# Altium schematic sheet [3] TopLevel.SchDoc: =DocumentName
size A3; Organization: ORGANIZATION; Address1: R. Aprígio Veloso, 882, Universitário; Address2: Campina Grande - PB; Address3: 58429-900; DocumentNumber: 3; Revision: -; SheetNumber: 3; SheetTotal: 9; ENG_DATE: --/--/--; DSN_DATE: --/--/--; CHK_DATE: --/--/--; SCH_SCALE: 1:1
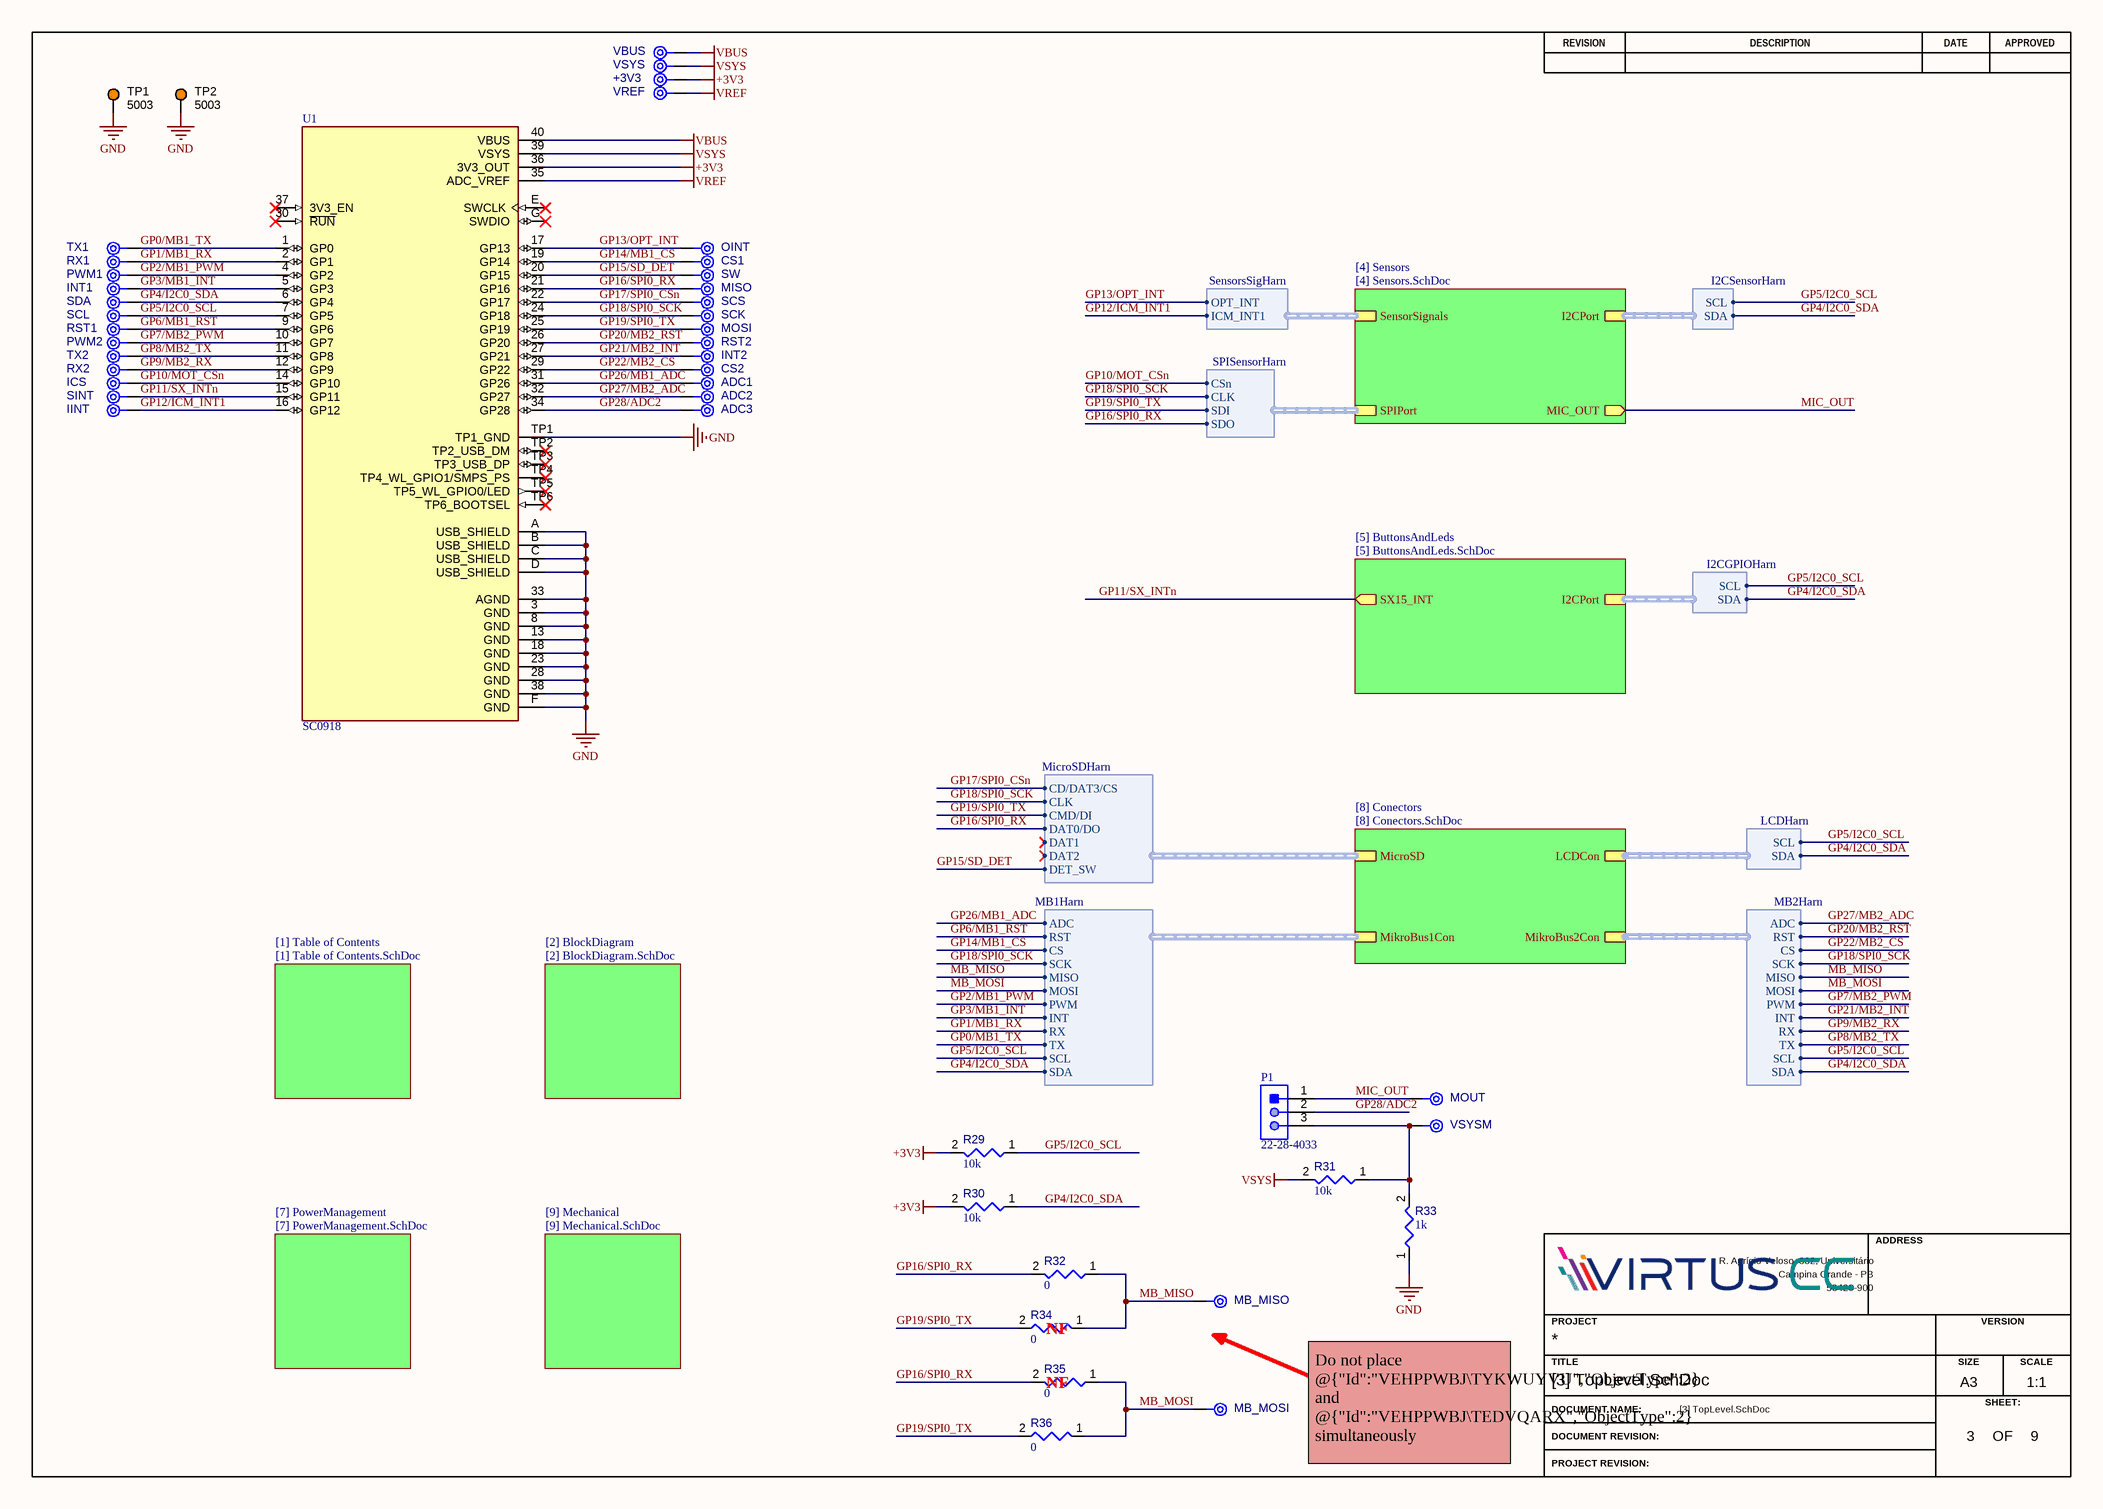
[diagram p0: [3] TopLevel.SchDoc]

## Parts
+3V3  TPAD6R  [TP06R]  (value not drawn)  (no BOM)
ADC1  TPAD6R  [TP06R]  (value not drawn)  (no BOM)
ADC2  TPAD6R  [TP06R]  (value not drawn)  (no BOM)
ADC3  TPAD6R  [TP06R]  (value not drawn)  (no BOM)
CS1  TPAD6R  [TP06R]  (value not drawn)  (no BOM)
CS2  TPAD6R  [TP06R]  (value not drawn)  (no BOM)
ICS  TPAD6R  [TP06R]  (value not drawn)  (no BOM)
IINT  TPAD6R  [TP06R]  (value not drawn)  (no BOM)
INT1  TPAD6R  [TP06R]  (value not drawn)  (no BOM)
INT2  TPAD6R  [TP06R]  (value not drawn)  (no BOM)
MB_MISO  TPAD6R  [TP06R]  (value not drawn)  (no BOM)
MB_MOSI  TPAD6R  [TP06R]  (value not drawn)  (no BOM)
MISO  TPAD6R  [TP06R]  (value not drawn)  (no BOM)
MOSI  TPAD6R  [TP06R]  (value not drawn)  (no BOM)
MOUT  TPAD6R  [TP06R]  (value not drawn)  (no BOM)
OINT  TPAD6R  [TP06R]  (value not drawn)  (no BOM)
P1  22-28-4033  [MOLX-22-28-4033_V]
PWM1  TPAD6R  [TP06R]  (value not drawn)  (no BOM)
PWM2  TPAD6R  [TP06R]  (value not drawn)  (no BOM)
R29  value 10k  [RESC0603(1608)_L]  (hidden comment: Resistor 10k +/-1% 0603 100 mW)
R30  value 10k  [RESC0603(1608)_L]  (hidden comment: Resistor 10k +/-1% 0603 100 mW)
R31  value 10k  [RESC0603(1608)_L]  (hidden comment: Resistor 10k +/-1% 0603 100 mW)
R32  value 0  [RESC0603(1608)_L]  (hidden comment: Resistor 0R +/- 5% 0603 100 mW)
R33  value 1k  [RESC0603(1608)_L]  (hidden comment: Resistor 1k +/-1% 0603 100 mW)
R34  value 0  [RESC0603(1608)_L]  (hidden comment: Resistor 0R +/- 5% 0603 100 mW)
R35  value 0  [RESC0603(1608)_L]  (hidden comment: Resistor 0R +/- 5% 0603 100 mW)
R36  value 0  [RESC0603(1608)_L]  (hidden comment: Resistor 0R +/- 5% 0603 100 mW)
RST1  TPAD6R  [TP06R]  (value not drawn)  (no BOM)
RST2  TPAD6R  [TP06R]  (value not drawn)  (no BOM)
RX1  TPAD6R  [TP06R]  (value not drawn)  (no BOM)
RX2  TPAD6R  [TP06R]  (value not drawn)  (no BOM)
SCK  TPAD6R  [TP06R]  (value not drawn)  (no BOM)
SCL  TPAD6R  [TP06R]  (value not drawn)  (no BOM)
SCS  TPAD6R  [TP06R]  (value not drawn)  (no BOM)
SDA  TPAD6R  [TP06R]  (value not drawn)  (no BOM)
SINT  TPAD6R  [TP06R]  (value not drawn)  (no BOM)
SW  TPAD6R  [TP06R]  (value not drawn)  (no BOM)
TP1  5003  [KSTN-5003]
TP2  5003  [KSTN-5003]
TX1  TPAD6R  [TP06R]  (value not drawn)  (no BOM)
TX2  TPAD6R  [TP06R]  (value not drawn)  (no BOM)
U1  SC0918  [MODULE_SC0918]
VBUS  TPAD6R  [TP06R]  (value not drawn)  (no BOM)
VREF  TPAD6R  [TP06R]  (value not drawn)  (no BOM)
VSYS  TPAD6R  [TP06R]  (value not drawn)  (no BOM)
VSYSM  TPAD6R  [TP06R]  (value not drawn)  (no BOM)

## Sub-sheets
[1] Table of Contents = [1] Table of Contents.SchDoc: no entries
[2] BlockDiagram = [2] BlockDiagram.SchDoc: no entries
[4] Sensors = [4] Sensors.SchDoc: I2CPort (harness I2CSensorHarn), SPIPort (harness SPISensorHarn), SensorSignals (harness SensorsSigHarn), MIC_OUT (out)
[5] ButtonsAndLeds = [5] ButtonsAndLeds.SchDoc: SX15_INT (out), I2CPort (harness I2CGPIOHarn)
[7] PowerManagement = [7] PowerManagement.SchDoc: no entries
[8] Conectors = [8] Conectors.SchDoc: MikroBus1Con (harness MB1Harn), MicroSD (harness MicroSDHarn), MikroBus2Con (harness MB2Harn), LCDCon (harness LCDHarn)
[9] Mechanical = [9] Mechanical.SchDoc: no entries

## Harnesses
I2CSensorHarn: SCL, SDA
SPISensorHarn: CSn, CLK, SDI, SDO
SensorsSigHarn: OPT_INT, ICM_INT1
I2CGPIOHarn: SCL, SDA
LCDHarn: SCL, SDA
MicroSDHarn: CD/DAT3/CS, CLK, CMD/DI, DAT0/DO, DAT1, DAT2, DET_SW
MB1Harn: ADC, RST, CS, SCK, MISO, MOSI, PWM, INT, RX, TX, SCL, SDA
MB2Harn: ADC, RST, CS, SCK, MISO, MOSI, PWM, INT, RX, TX, SCL, SDA

## Nets
+3V3: +3V3.1(TP) R29.2 R30.2 U1.36(3V3_OUT)
GND: R33.1 TP1.1 TP2.1 U1.3(GND) U1.8(GND) U1.13(GND) U1.18(GND) U1.23(GND) U1.28(GND) U1.33(AGND) U1.38(GND) U1.A(USB_SHIELD) U1.B(USB_SHIELD) U1.C(USB_SHIELD) U1.D(USB_SHIELD) U1.F(GND) U1.TP1(TP1_GND)
VBUS: U1.40(VBUS) VBUS.1(TP)
VREF: U1.35(ADC_VREF) VREF.1(TP)
VSYS: R31.2 U1.39(VSYS) VSYS.1(TP)
GP0/MB1_TX: TX1.1(TP) U1.1(GP0) ; sheet [8] Conectors/MikroBus1Con.TX
GP1/MB1_RX: RX1.1(TP) U1.2(GP1) ; sheet [8] Conectors/MikroBus1Con.RX
GP2/MB1_PWM: PWM1.1(TP) U1.4(GP2) ; sheet [8] Conectors/MikroBus1Con.PWM
GP3/MB1_INT: INT1.1(TP) U1.5(GP3) ; sheet [8] Conectors/MikroBus1Con.INT
GP4/I2C0_SDA: R30.1 SDA.1(TP) U1.6(GP4) ; sheet [4] Sensors/I2CPort.SDA, sheet [5] ButtonsAndLeds/I2CPort.SDA, sheet [8] Conectors/LCDCon.SDA, sheet [8] Conectors/MikroBus1Con.SDA, sheet [8] Conectors/MikroBus2Con.SDA
GP5/I2C0_SCL: R29.1 SCL.1(TP) U1.7(GP5) ; sheet [4] Sensors/I2CPort.SCL, sheet [5] ButtonsAndLeds/I2CPort.SCL, sheet [8] Conectors/LCDCon.SCL, sheet [8] Conectors/MikroBus1Con.SCL, sheet [8] Conectors/MikroBus2Con.SCL
GP6/MB1_RST: RST1.1(TP) U1.9(GP6) ; sheet [8] Conectors/MikroBus1Con.RST
GP7/MB2_PWM: PWM2.1(TP) U1.10(GP7) ; sheet [8] Conectors/MikroBus2Con.PWM
GP8/MB2_TX: TX2.1(TP) U1.11(GP8) ; sheet [8] Conectors/MikroBus2Con.TX
GP9/MB2_RX: RX2.1(TP) U1.12(GP9) ; sheet [8] Conectors/MikroBus2Con.RX
GP10/MOT_CSn: ICS.1(TP) U1.14(GP10) ; sheet [4] Sensors/SPIPort.CSn
GP11/SX_INTn: SINT.1(TP) U1.15(GP11) ; sheet [5] ButtonsAndLeds/SX15_INT
GP12/ICM_INT1: IINT.1(TP) U1.16(GP12) ; sheet [4] Sensors/SensorSignals.ICM_INT1
GP13/OPT_INT: OINT.1(TP) U1.17(GP13) ; sheet [4] Sensors/SensorSignals.OPT_INT
GP14/MB1_CS: CS1.1(TP) U1.19(GP14) ; sheet [8] Conectors/MikroBus1Con.CS
GP15/SD_DET: SW.1(TP) U1.20(GP15) ; sheet [8] Conectors/MicroSD.DET_SW
GP16/SPI0_RX: MISO.1(TP) R32.2 R35.2 U1.21(GP16) ; sheet [4] Sensors/SPIPort.SDO, sheet [8] Conectors/MicroSD.DAT0/DO
GP17/SPI0_CSn: SCS.1(TP) U1.22(GP17) ; sheet [8] Conectors/MicroSD.CD/DAT3/CS
GP18/SPI0_SCK: SCK.1(TP) U1.24(GP18) ; sheet [4] Sensors/SPIPort.CLK, sheet [8] Conectors/MicroSD.CLK, sheet [8] Conectors/MikroBus1Con.SCK, sheet [8] Conectors/MikroBus2Con.SCK
GP19/SPI0_TX: MOSI.1(TP) R34.2 R36.2 U1.25(GP19) ; sheet [4] Sensors/SPIPort.SDI, sheet [8] Conectors/MicroSD.CMD/DI
GP20/MB2_RST: RST2.1(TP) U1.26(GP20) ; sheet [8] Conectors/MikroBus2Con.RST
GP21/MB2_INT: INT2.1(TP) U1.27(GP21) ; sheet [8] Conectors/MikroBus2Con.INT
GP22/MB2_CS: CS2.1(TP) U1.29(GP22) ; sheet [8] Conectors/MikroBus2Con.CS
GP26/MB1_ADC: ADC1.1(TP) U1.31(GP26) ; sheet [8] Conectors/MikroBus1Con.ADC
GP27/MB2_ADC: ADC2.1(TP) U1.32(GP27) ; sheet [8] Conectors/MikroBus2Con.ADC
GP28/ADC2: ADC3.1(TP) P1.2 U1.34(GP28)
MB_MISO: MB_MISO.1(TP) R32.1 R34.1 ; sheet [8] Conectors/MikroBus1Con.MISO, sheet [8] Conectors/MikroBus2Con.MISO
MB_MOSI: MB_MOSI.1(TP) R35.1 R36.1 ; sheet [8] Conectors/MikroBus1Con.MOSI, sheet [8] Conectors/MikroBus2Con.MOSI
MIC_OUT: MOUT.1(TP) P1.1 ; sheet [4] Sensors/MIC_OUT
NetP1_3: P1.3 R31.1 R33.2 VSYSM.1(TP)

Not connected (* = marked no-connect by the designer): U1 30(~{RUN})* 37(3V3_EN)* E(SWCLK)* G(SWDIO)* TP2(TP2_USB_DM)* TP3(TP3_USB_DP)* TP4(TP4_WL_GPIO1/SMPS_PS)* TP5(TP5_WL_GPIO0/LED)* TP6(TP6_BOOTSEL)*

## Notes on the sheet
- (near R34) NF
- (near R35) NF
- Do not place @{"Id":"VEHPPWBJ\TYKWUYVU","ObjectType":2} and @{"Id":"VEHPPWBJ\TEDVQARX","ObjectType":2}  simultaneously
  Do not place @{"Id":"VEHPPWBJ\RVHFYNCN","ObjectType":2} and @{"Id":"VEHPPWBJ\JGYLNFBT","ObjectType":2}  simultaneously
- REVISION
- DESCRIPTION
- DATE
- APPROVED
- ADDRESS
- PROJECT
- VERSION
- TITLE
- A3
- SIZE
- SCALE
- DOCUMENT NAME:
- DOCUMENT REVISION:
- OF
- SHEET:
- PROJECT REVISION:

## Library data of the parts
+3V3 ADC1-ADC3 CS1 CS2 ICS IINT INT1 INT2 MB_MISO MB_MOSI MISO MOSI MOUT OINT PWM1 PWM2 RST1 RST2 RX1 RX2 SCK SCL SCS SDA SINT SW TX1 TX2 VBUS VREF VSYS VSYSM = CMP-00028-00002-2: 0.6mm round; Pins: 1
P1 = CMP-002-00076-1: KK 254 Breakaway Header Vertical 3 Circuits 0.38um Gold Selective Plating Mating Pin 6.09mm; Pitch: 2.54mm; Number of Positions: 3; Contact Resistance: 20mR; Max Voltage Rating (AC): 250V; Current Rating: 4A; Gender: Male; Glow Wire Compliant: Non-compliant; RoHS Compliant: Yes; Contact Plating: Gold; Housing Color: Black; Housing Material: Nylon; Contact Mating Length: 0.24inch; Depth: 2.49mm; Number of Circuits: 3; Reach SVHC Compliant: Unknown; Packaging: Bulk; Max Voltage Rating (DC): 250V; Number of Rows: 1; Color: Black; Package Quantity: 1; Orientation: Straight; Number of Contacts: 3; Max Operating Temperature: 75°C; Mounting Technology: Through Hole; Min Operating Temperature: 0°C; Termination: Solder; Radiation Hardening: No; Series: KK® 42375; Contact Material: Brass,Bronze; Flammability Rating: UL94 V-0; Lead Free: Lead Free; Contact Type: Male Pin; Voltage Rating: 250V; Voltage Rating (DC): 250V
R29-R31 = CMP-009-00017-7: Chip Resistor, 10 KOhm, +/- 1%, 01 W, -55 to 155 degC, 0603 (1608 Metric); Power: 100mW; Voltage Rating: 50V; Mounting Technology: SM; Max Operating Temperature: 155°C; Case/Package: 0603; Tolerance: 1%; RoHS Compliant: True; Pins: 2; Min Operating Temperature: -55°C
R32 R34-R36 = CMP-009-00006-6: Chip Resistor, 0 Ohm, 0.1 W, -55 to 155 degC, 0603 (1608 Metric); Power: 100mW; Voltage Rating: 50V; Tolerance: 5%; Mounting Technology: SM; RoHS Compliant: True; Max Operating Temperature: 155°C; Min Operating Temperature: -55°C; Case/Package: 0603; Pins: 2
R33 = CMP-009-00014-6: Chip Resistor, 1 KOhm, +/-1%, 0.1 W, -55 to 155 degC, 0603 (1608 Metric); Power: 100mW; Tolerance: 1%; Voltage Rating: 50V; Mounting Technology: SM; Case/Package: 0603; Min Operating Temperature: -55°C; RoHS Compliant: True; Max Operating Temperature: 155°C; Pins: 2
TP1 TP2 = CMP-002-00037-2: Test Point, Orange, Height 4.6 mm, Tail Length 3 mm, 1-Pin THD, RoHS; Manufacturer: Keystone; Colour: Orange; Packaging: Bulk; Package Description: 1-Pin Through Hole Device, Dia 2.54 mm; Pins: 1; Package Reference: 5003; Datasheet Version: Jun-15; Case/Package: 5003; Mounting Technology: TH; Connector Type: TestPoint; Diameter: 2.54mm; Contact Material: Bronze; Datasheet URL: http://keyelco.com/userAssets/file/M65p56.pdf; Manufacturer URL: http://www.keyelco.com/; Package Quantity: 10; Contact Plating: Tin; RoHS Compliant: True
U1 = CMP-006-000001-6: Raspberry Pi Pico W RP2040; Pin Count: 53; MP: SC0918; Availability: In Stock; Source: SC0918.SchLib; Purchase-URL: https://pricing.snapeda.com/search/part/SC0918/?ref=eda; Price: None; MF: Raspberry Pi; Component Type: Standard; Design Item ID: SC0918; SnapEDA_Link: https://www.snapeda.com/parts/SC0918/Raspberry+Pi/view-part/?ref=snap; Check_prices: https://www.snapeda.com/parts/SC0918/Raspberry+Pi/view-part/?ref=eda; Value: *; Package: None; Manufacturer: Raspberry Pi; Manufacturer Part Number: SC0918; Component Type: Processors